# Altium schematic sheet GSM-Board.SchDoc
size A4; SheetNumber: 1; SheetTotal: 1
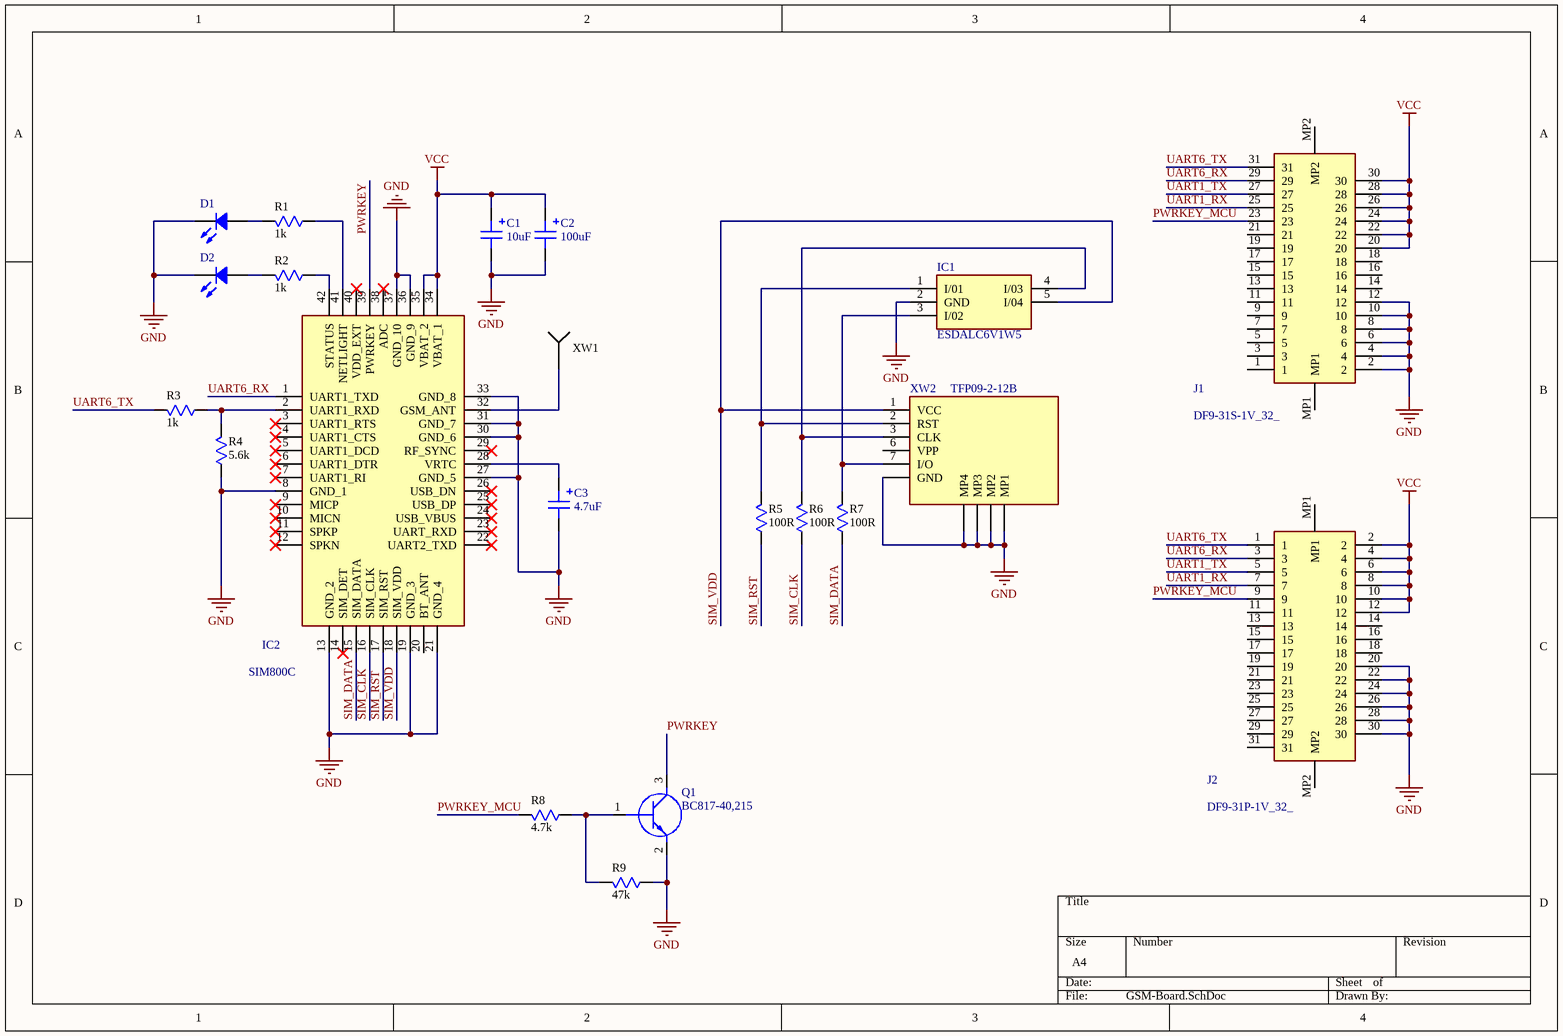
[diagram p0: GSM-Board.SchDoc]

## Parts
C1  10uF  [CAP: TANTAL-B]
C2  100uF  [CAP: TANTAL-D]
C3  4.7uF  [CAP: TANTAL-A]
D1  (no value)  [LED0805]
D2  (no value)  [LED0805]
IC1  ESDALC6V1W5  [SOT65P210X110-5N]
IC2  SIM800C  [SIM800C]
J1  DF9-31S-1V_32_  [DF931S1V32]
J2  DF9-31P-1V_32_  [DF931P1V32]
Q1  BC817-40,215  [BC81740215]
R1  value 1k  [RES: 0805]
R2  value 1k  [RES: 0805]
R3  value 1k  [RES: 0805]
R4  value 5.6k  [RES: 0805]
R5  value 100R  [RES: 0805]
R6  value 100R  [RES: 0805]
R7  value 100R  [RES: 0805]
R8  value 4.7k  [RES: 0805]
R9  value 47k  [RES: 0805]
XW1  (no value)  [ANT_HOLE]
XW2  TFP09-2-12B  [SIMHOLDER]

## Nets
GND: C1.2 C2.2 C3.2 D1.2 D2.2 IC1.2(GND) IC2.8(GND_1) IC2.13(GND_2) IC2.19(GND_3) IC2.21(GND_4) IC2.27(GND_5) IC2.30(GND_6) IC2.31(GND_7) IC2.33(GND_8) IC2.36(GND_9) IC2.37(GND_10) J1.2 J1.4 J1.6 J1.8 J1.10 J1.12 J2.20 J2.22 J2.24 J2.26 J2.28 J2.30 Q1.2(E) R4.1 R9.1 XW2.5(GND) XW2.MP1 XW2.MP2 XW2.MP3 XW2.MP4
VCC: C1.1 C2.1 IC2.34(VBAT_1) IC2.35(VBAT_2) J1.20 J1.22 J1.24 J1.26 J1.28 J1.30 J2.2 J2.4 J2.6 J2.8 J2.10 J2.12
PWRKEY: IC2.39(PWRKEY) Q1.3(C)
PWRKEY_MCU: J1.23 J2.9 R8.2
SIM_CLK: IC2.16(SIM_CLK) R6.1
SIM_DATA: IC2.15(SIM_DATA) R7.1
SIM_RST: IC2.17(SIM_RST) R5.1
SIM_VDD: IC1.5(I/04) IC2.18(SIM_VDD) XW2.1(VCC)
UART1_RX: J1.25 J2.7
UART1_TX: J1.27 J2.5
UART6_RX: IC2.1(UART1_TXD) J1.29 J2.3
UART6_TX: J1.31 J2.1 R3.2
NetC3_1: C3.1 IC2.28(VRTC)
NetD1_1: D1.1 R1.2
NetD2_1: D2.1 R2.2
NetIC1_1: IC1.1(I/01) R5.2 XW2.2(RST)
NetIC1_3: IC1.3(I/02) R7.2 XW2.7(I/O)
NetIC1_4: IC1.4(I/03) R6.2 XW2.3(CLK)
NetIC2_2: IC2.2(UART1_RXD) R3.1 R4.2
NetIC2_32: IC2.32(GSM_ANT) XW1.1(SIG)
NetIC2_41: IC2.41(NETLIGHT) R1.1
NetIC2_42: IC2.42(STATUS) R2.1
NetQ1_1: Q1.1(B) R8.1 R9.2

Not connected (* = marked no-connect by the designer): IC2 3(UART1_RTS)* 4(UART1_CTS)* 5(UART1_DCD)* 6(UART1_DTR)* 7(UART1_RI)* 9(MICP)* 10(MICN)* 11(SPKP)* 12(SPKN)* 14(SIM_DET)* 20(BT_ANT) 22(UART2_TXD)* 23(UART_RXD)* 24(USB_VBUS)* 25(USB_DP)* 26(USB_DN)* 29(RF_SYNC)* 38(ADC)* 40(VDD_EXT)*; J1 1 3 5 7 9 11 13 14 15 16 17 18 19 21 MP1 MP2; J2 11 13 14 15 16 17 18 19 21 23 25 27 29 31 MP1 MP2; XW2 6(VPP)

## Library data of the parts
C1-C3 = Capacitor_polar: SMD Capacitor Polar
D1 D2 = LED: Chip LED
IC1 = ESDALC6V1W5: Integrated Circuit; Manufacturer_Name: STMicroelectronics; Datasheet Link: http://www.st.com/web/en/resource/technical/document/datasheet/CD00002946.pdf; Height: 1.1mm; Manufacturer_Part_Number: ESDALC6V1W5; Mouser Part Number: 511-ESDALC6V1W5; Mouser Price/Stock: https://www.mouser.co.uk/ProductDetail/STMicroelectronics/ESDALC6V1W5?qs=C%2FEejvvdwQ4xcyFnfrFaDw%3D%3D; Arrow Part Number: ESDALC6V1W5; Arrow Price/Stock: https://www.arrow.com/en/products/esdalc6v1w5/stmicroelectronics?region=nac
IC2 = -SIM800C: Integrated Circuit; Manufacturer_Name: SIMCOM; Datasheet Link: https://datasheet.lcsc.com/szlcsc/SIMCom-Wireless-Solutions-SIM800C-24Mbit_C69119.pdf; Manufacturer_Part_Number: -SIM800C
J1 = DF9-31S-1V_32_: Connector; Manufacturer_Name: Hirose; Manufacturer_Part_Number: DF9-31S-1V(32); Datasheet Link: http://www.mouser.com/ds/2/185/DF9_catalog-939217.pdf; Height: 3.3mm; Mouser Part Number: 798-DF9-31S-1V32; Mouser Price/Stock: https://www.mouser.co.uk/ProductDetail/Hirose-Connector/DF9-31S-1V32?qs=zOgoZG1CgI88k8P2oY2QVw%3D%3D; Arrow Part Number: DF9-31S-1V(32); Arrow Price/Stock: https://www.arrow.com/en/products/df9-31s-1v-32/hirose-electric; System: Connector
J2 = DF9-31P-1V_32_: Connector; Manufacturer_Name: Hirose; Manufacturer_Part_Number: DF9-31P-1V(32); Datasheet Link: https://datasheet.datasheetarchive.com/originals/distributors/SFDatasheet-7/sf-000141250.pdf; Height: 3.5mm; Mouser Part Number: 798-DF9-31P-1V32; Mouser Price/Stock: https://www.mouser.co.uk/ProductDetail/Hirose-Connector/DF9-31P-1V32?qs=zOgoZG1CgI9P5hPtT7oVcw%3D%3D; Arrow Part Number: DF9-31P-1V(32); Arrow Price/Stock: https://www.arrow.com/en/products/df9-31p-1v-32/hirose-electric; System: Connector
Q1 = BC817-40,215: Transistor BJT NPN; Manufacturer_Name: Nexperia; Datasheet Link: https://assets.nexperia.com/documents/data-sheet/BC817_SER.pdf; Height: 1.1mm; Manufacturer_Part_Number: BC817-40,215; Mouser Part Number: 771-BC817-40-T/R; Mouser Price/Stock: https://www.mouser.co.uk/ProductDetail/Nexperia/BC817-40215?qs=me8TqzrmIYU%252B245p8hOLaQ%3D%3D; Arrow Part Number: BC817-40,215; Arrow Price/Stock: https://www.arrow.com/en/products/bc817-40215/nexperia?region=nac
R1-R9 = Resistor: Manufacturer: Yageo; PartNumber: RC0201JR-07100RL; TypeResistor: Resistor film; Power: 0.05W; Package: 0201; HelpURL: https://www.digikey.com/product-detail/en/yageo/RC0201JR-07100RL/311-100NCT-ND/1949006; ValueManufacturerPartNumber: =TypeResistor+', '+Value+', '+Tolerance+', '+Package+', '+Power+', '+Temperature; Temperature: -55...+125°C
XW1 = Connector RF
XW2 = TFP09-2-12B: Connector; Manufacturer_Name: 100y; Datasheet Link: http://images.100y.com.tw/pdf_file/10-TFP09-2-12B.pdf; Height: 2.45mm; Manufacturer_Part_Number: TFP09-2-12B